# Altium schematic sheet T-LOG v2.0.SchDoc
size 420 x 297 mm
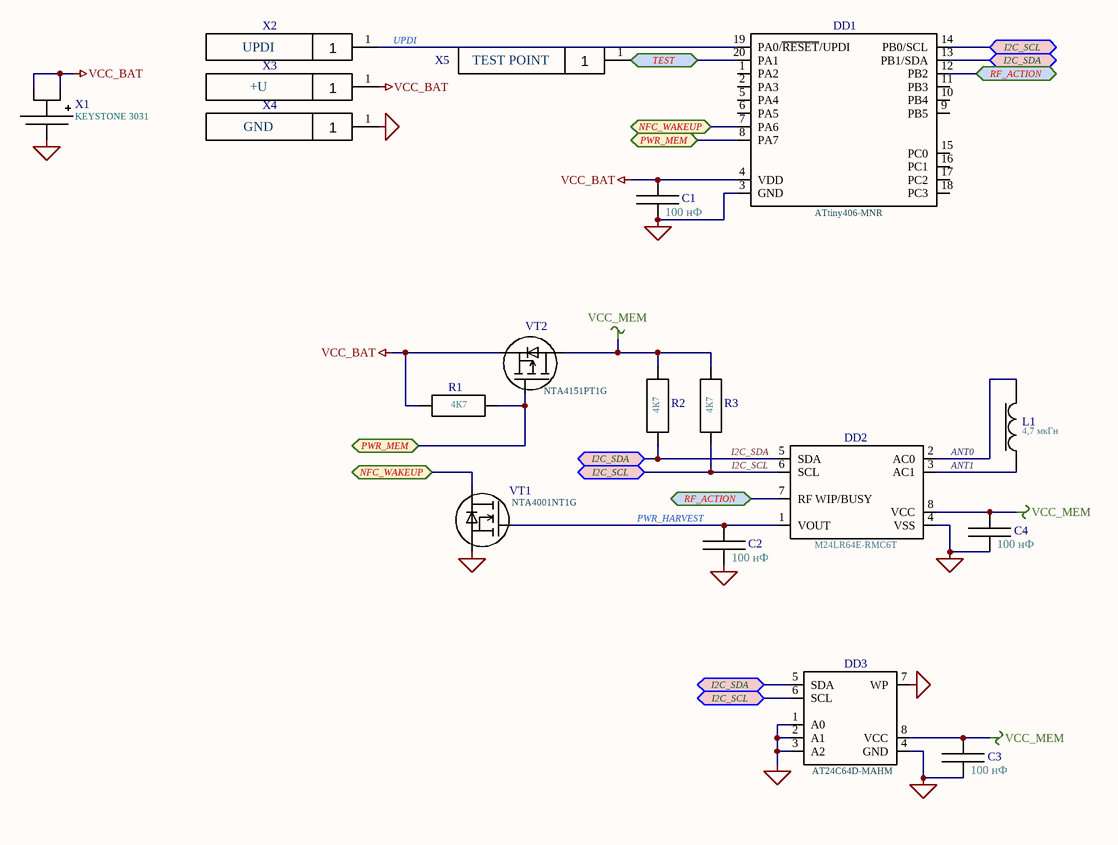
[diagram p0: T-LOG v2.0.SchDoc]

## Parts
C1  100 нФ  [C0402]
C2  100 нФ  [C0402]
C3  100 нФ  [C0402]
C4  100 нФ  [C0402]
DD1  ATtiny406-MNR  [VQFN20_3x3_0.4]
DD2  M24LR64E-RMC6T  [UDFN-8_2X3]
DD3  AT24C64D-MAHM  [UDFN-8_2X3]
L1  4,7 мкГн  [WE-LQ_1210]
R1  4К7  [R0402]
R2  4К7  [R0402]
R3  4К7  [R0402]
VT1  NTA4001NT1G  [SC-75]
VT2  NTA4151PT1G  [SC-75]
X1  KEYSTONE 3031  [KEYSTONE_3031]
X2  VIA_0.5x1x2_RECTANGLE  [VIA_0.5x1x2_RECTANGLE]  (value not drawn)  (no BOM)
X3  VIA_0.5x1x2_RECTANGLE  [VIA_0.5x1x2_RECTANGLE]  (value not drawn)  (no BOM)
X4  VIA_0.5x1x2_RECTANGLE  [VIA_0.5x1x2_RECTANGLE]  (value not drawn)  (no BOM)
X5  VIA_0.5x1x2_RECTANGLE  [VIA_0.5x1x2_RECTANGLE]  (value not drawn)  (no BOM)

## Ports
I2C_SCL (bidir), I2C_SDA (bidir), NFC_WAKEUP (bidir), PWR_MEM (bidir), RF_ACTION (bidir), TEST (bidir)

## Nets
GND: C1.1 C2.1 C3.1 C4.1 DD1.3(GND) DD2.4(VSS) DD3.1(A0) DD3.2(A1) DD3.3(A2) DD3.4(GND) DD3.7(WP) VT1.2(S) X1.3 X4.1
VCC_BAT: C1.2 DD1.4(VDD) R1.2 VT2.2(S) X1.1 X1.2 X3.1
VCC_MEM: C3.2 C4.2 DD2.8(VCC) DD3.8(VCC) R2.2 R3.2 VT2.3(D)
ANT0: DD2.2(AC0) L1.2
ANT1: DD2.3(AC1) L1.1
I2C_SCL: DD1.14(PB0/SCL) DD2.6(SCL) DD3.6(SCL) R3.1 ; port I2C_SCL
I2C_SDA: DD1.13(PB1/SDA) DD2.5(SDA) DD3.5(SDA) R2.1 ; port I2C_SDA
NFC_WAKEUP: DD1.7(PA6) VT1.3(D) ; port NFC_WAKEUP
PWR_HARVEST: C2.2 DD2.1(VOUT) VT1.1(G)
PWR_MEM: DD1.8(PA7) R1.1 VT2.1(G) ; port PWR_MEM
RF_ACTION: DD1.12(PB2) DD2.7(RF_WIP/BUSY) ; port RF_ACTION
TEST: DD1.20(PA1) X5.1 ; port TEST
UPDI: DD1.19(PA0/~{RESET}/UPDI) X2.1

Not connected (* = marked no-connect by the designer): DD1 1(PA2) 2(PA3) 5(PA4) 6(PA5) 9(PB5) 10(PB4) 11(PB3) 15(PC0) 16(PC1) 17(PC2) 18(PC3)

## Notes on the sheet
- UPDI
- +U
- TEST POINT
- GND
- Перв. Примен.
- Справ. №
- Н.контр.
- Подп и дата
- Инв.№ дубл.
- Взам. инв.№
- Изм.
- Лист
- № докум.
- Подп.
- Дата
- Лит.
- Масса.
- Масштаб
- Пров.
- Т.Контр.
- Разраб.
- Схема электрическая
- принципиальная
- Листов
- б/м
- Инв.№подп.
- Н.Контр.
- Утв.
- Копировал:
- Формат А3

## Library data of the parts
C1-C4 = C0402: Чип-конденсатор 0,1 мкФ 50 В 0402; TYPE: Чип-конденсатор 0402
DD1 = ATtiny406-MNR: Микроконтроллер AVR ATtiny406-MNR VQFN20
DD2 = M24LR64E-RMC6T: Память EEPROM I2C/NFC 64Кбит M24LR64E-RMC6T UFDFN8 ST
DD3 = AT24C64D-MAHM: Память EEPROM I2C 64 Кбит AT24C64D‑MAHM UDFN8
L1 = WE-LQ_744032004: Чип-индуктивность WE-LQ 744032004 4,7 мкГн 0,49 А Wurth Elektronik; TYPE: LQM2HPN2R2MJ0
R1-R3 = R0402: Чип-резистор 4,7 кОм 5% 0402; TYPE: Чип-резистор 0402
VT1 = NTA4001NT1G: Транзистор MOSFET N-Channel NTA4001NT1G
VT2 = NTA4151PT1G: Транзистор MOSFET P-Channel NTA4151PT1G
X1 = KEYSTONE_3031: Держатель элемента CR1025 KEYSTONE 3031